# EAGLE design Swarm Board_2 (EAGLE 6.2)
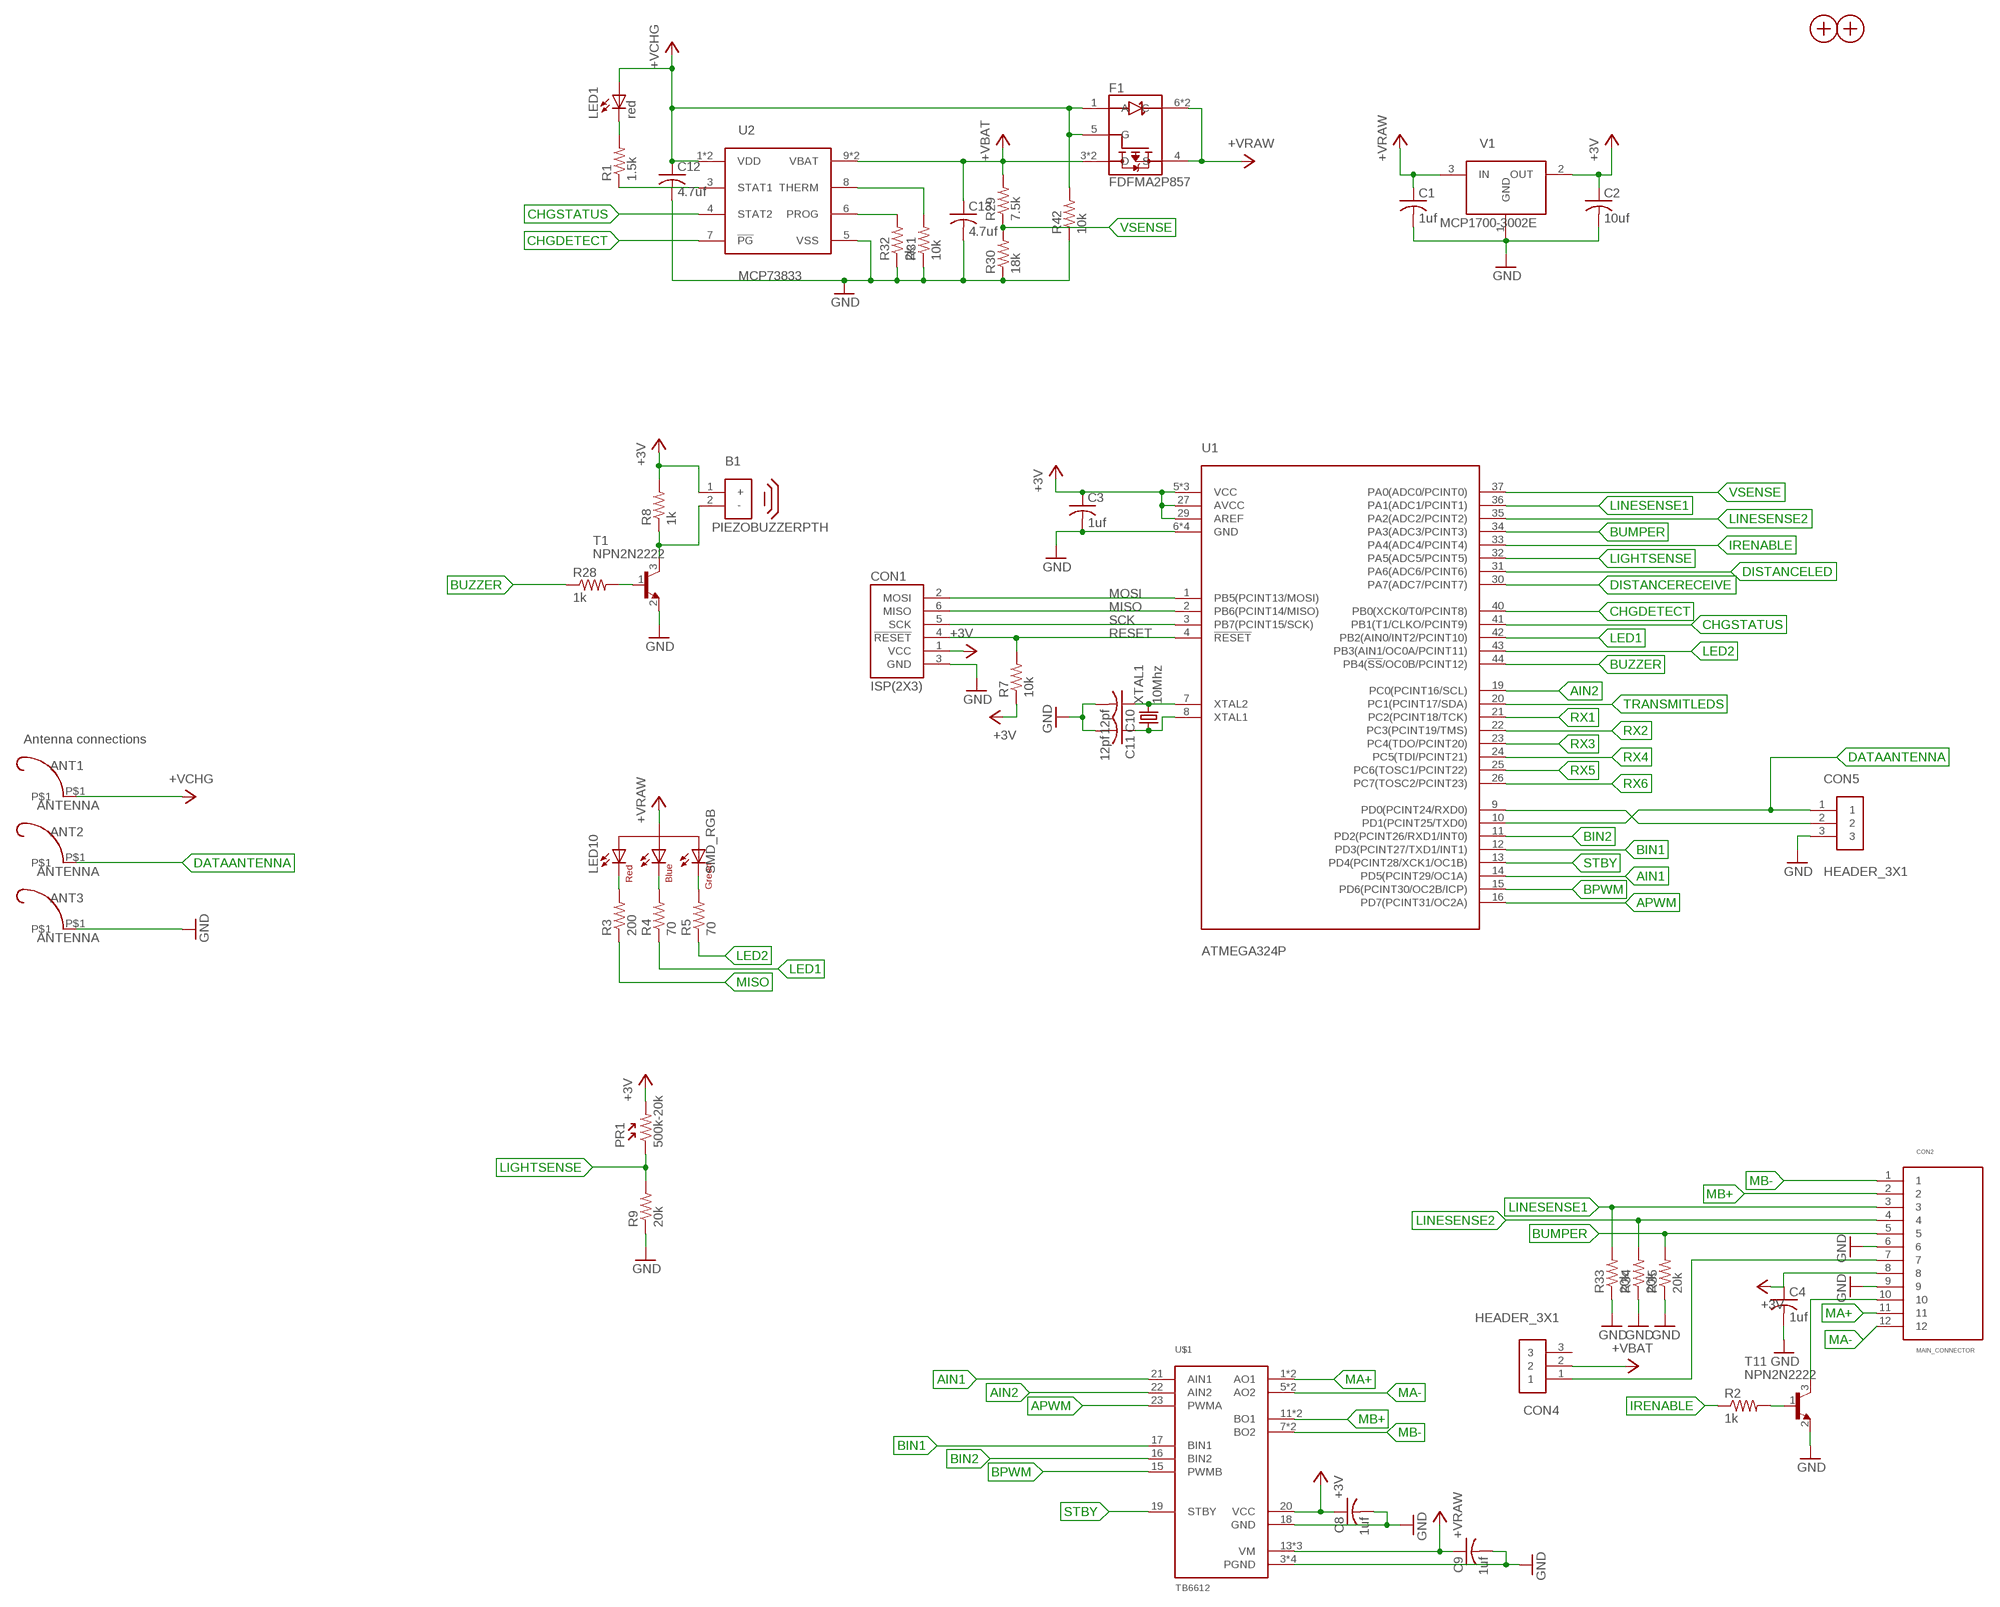
[diagram p0: schematic, sheet 1, part 1 of 2]
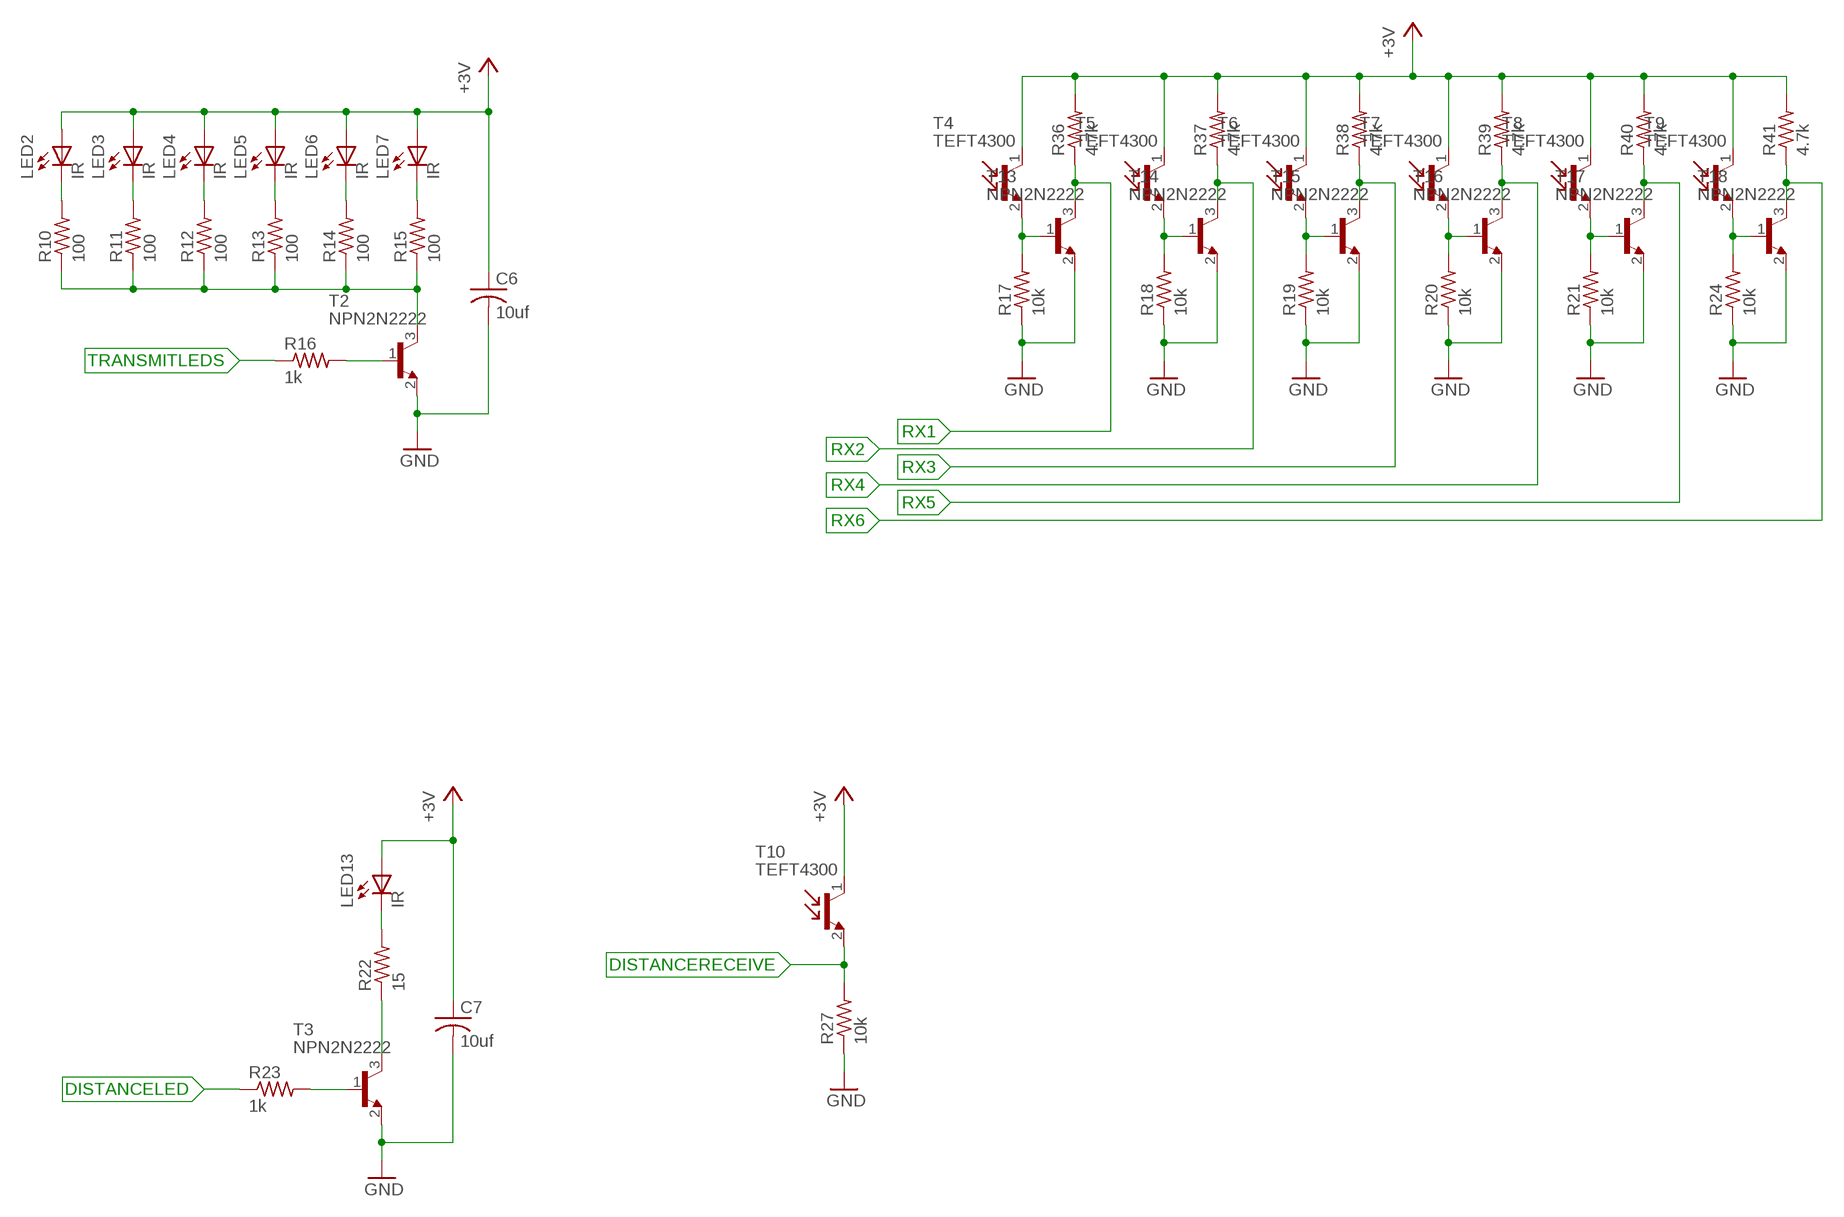
[diagram p1: schematic, sheet 1, part 2 of 2]

## Parts
ANT1  ANTENNA  [ANTENNA]
ANT2  ANTENNA  [ANTENNA]
ANT3  ANTENNA  [ANTENNA]
B1  PIEZOBUZZERPTH  [PIEZOBUZZER]
C1  1uf  CAP0603  [0603]
C2  10uf  CAP0805  [0805]
C3  1uf  CAP0603  [0603]
C4  1uf  CAP0603  [0603]
C6  10uf  CAP0805  [0805]
C7  10uf  CAP0805  [0805]
C8  1uf  CAP0603  [0603]
C9  1uf  CAP0603  [0603]
C10  12pf  CAP0603  [0603]
C11  12pf  CAP0603  [0603]
C12  4.7uf  CAP0603  [0603]
C13  4.7uf  CAP0603  [0603]
CON1  ISP(2X3)  [PINHEADER(2X3)]
CON2  MAIN_CONNECTOR  [FEMALE_HEADER_2MM_2X6]
CON4  HEADER_3X1  [3PINHEADER_.100"]
CON5  HEADER_3X1  [3PINHEADER_.100"]
F1  FDFMA2P857  [MICROFET2X2MM]
H1  MOUNTINGHOLE  [MOUNTINGHOLE]
H2  MOUNTINGHOLE  [MOUNTINGHOLE]
LED1  red  LED0603  [LED0603]
LED2  IR  LED5MMRA  [5MM_LED_RA]
LED3  IR  LED5MMRA  [5MM_LED_RA]
LED4  IR  LED5MMRA  [5MM_LED_RA]
LED5  IR  LED5MMRA  [5MM_LED_RA]
LED6  IR  LED5MMRA  [5MM_LED_RA]
LED7  IR  LED5MMRA  [5MM_LED_RA]
LED10  SMD_RGB  [PLCC4]
LED13  IR  LED5MMRA  [5MM_LED_RA]
PR1  500k-20k  CDSPHOTORESISTOR  [CDSPHOTOCELL]
R1  1.5k  RES0603  [0603]
R2  1k  RES0603  [0603]
R3  200  RES0603  [0603]
R4  70  RES0603  [0603]
R5  70  RES0603  [0603]
R7  10k  RES0603  [0603]
R8  1k  RES0603  [0603]
R9  20k  RES0603  [0603]
R10  100  RES0603  [0603]
R11  100  RES0603  [0603]
R12  100  RES0603  [0603]
R13  100  RES0603  [0603]
R14  100  RES0603  [0603]
R15  100  RES0603  [0603]
R16  1k  RES0603  [0603]
R17  10k  RES0603  [0603]
R18  10k  RES0603  [0603]
R19  10k  RES0603  [0603]
R20  10k  RES0603  [0603]
R21  10k  RES0603  [0603]
R22  15  RES0603  [0603]
R23  1k  RES0603  [0603]
R24  10k  RES0603  [0603]
R27  10k  RES0603  [0603]
R28  1k  RES0603  [0603]
R29  7.5k  RES0603  [0603]
R30  18k  RES0603  [0603]
R31  10k  RES0603  [0603]
R32  2k  RES0603  [0603]
R33  20k  RES0603  [0603]
R34  20k  RES0603  [0603]
R35  20k  RES0603  [0603]
R36  4.7k  RES0603  [0603]
R37  4.7k  RES0603  [0603]
R38  4.7k  RES0603  [0603]
R39  4.7k  RES0603  [0603]
R40  4.7k  RES0603  [0603]
R41  4.7k  RES0603  [0603]
R42  10k  RES0603  [0603]
T1  NPN2N2222  [SOT23]
T2  NPN2N2222  [SOT23]
T3  NPN2N2222  [SOT23]
T4  TEFT4300  [3MM_LED_RA]
T5  TEFT4300  [3MM_LED_RA]
T6  TEFT4300  [3MM_LED_RA]
T7  TEFT4300  [3MM_LED_RA]
T8  TEFT4300  [3MM_LED_RA]
T9  TEFT4300  [3MM_LED_RA]
T10  TEFT4300  [3MM_LED_RA]
T11  NPN2N2222  [SOT23]
T13  NPN2N2222  [SOT23]
T14  NPN2N2222  [SOT23]
T15  NPN2N2222  [SOT23]
T16  NPN2N2222  [SOT23]
T17  NPN2N2222  [SOT23]
T18  NPN2N2222  [SOT23]
U1  ATMEGA324P  [TQFP44]
U2  MCP73833  [MSOP10]
U$1  TB6612  [24SSOP]
V1  MCP1700-3002E  [(TT/NB)SOT-23(3PAD)]
XTAL1  10Mhz  NX5032GA-10.000000MHZ  [SMDXTAL]

## Nets
+3V: B1.1(+) C2.1 C3.1 C4.1 C6.1 C7.1 C8.1 CON1.1(VCC) CON2.8 LED2.1(A) LED3.1(A) LED4.1(A) LED5.1(A) LED6.1(A) LED7.1(A) LED13.1(A) PR1.2 R7.1 R8.2 R36.2 R37.2 R38.2 R39.2 R40.2 R41.2 T4.1(C) T5.1(C) T6.1(C) T7.1(C) T8.1(C) T9.1(C) T10.1(C) U1.5(VCC) U1.17(VCC) U1.27(AVCC) U1.29(AREF) U1.38(VCC) U$1.20(VCC) V1.2(OUT)
+VBAT: C13.1 CON4.2 F1.3(D) F1.8(D) R29.2 U2.9(VBAT) U2.10(VBAT)
+VCHG: ANT1.P$1 C12.1 F1.1(A) F1.5(G) LED1.2(A) R42.2 U2.1(VDD) U2.2(VDD)
+VRAW: C1.1 C9.1 F1.4(S) F1.6(C) F1.7(C) LED10.2(COMMONANODE) U$1.13(VM) U$1.14(VM) U$1.24(VM) V1.3(IN)
AIN1: U1.14(PD5(PCINT29/OC1A)) U$1.21(AIN1)
AIN2: U1.19(PC0(PCINT16/SCL)) U$1.22(AIN2)
APWM: U1.16(PD7(PCINT31/OC2A)) U$1.23(PWMA)
BIN1: U1.12(PD3(PCINT27/TXD1/INT1)) U$1.17(BIN1)
BIN2: U1.11(PD2(PCINT26/RXD1/INT0)) U$1.16(BIN2)
BPWM: U1.15(PD6(PCINT30/OC2B/ICP)) U$1.15(PWMB)
BUMPER: CON2.5 R35.2 U1.34(PA3(ADC3/PCINT3))
BUZZER: R28.1 U1.44(PB4(!SS!/OC0B/PCINT12))
CHGDETECT: U1.40(PB0(XCK0/T0/PCINT8)) U2.7(!PG)
CHGSTATUS: U1.41(PB1(T1/CLKO/PCINT9)) U2.4(STAT2)
DATAANTENNA: ANT2.P$1 CON5.1 U1.10(PD1(PCINT25/TXD0))
DISTANCELED: R23.1 U1.31(PA6(ADC6/PCINT6))
DISTANCERECEIVE: R27.2 T10.2(E) U1.30(PA7(ADC7/PCINT7))
GND: ANT3.P$1 C1.2 C2.2 C3.2 C4.2 C6.2 C7.2 C8.2 C9.2 C10.2 C11.2 C12.2 C13.2 CON1.3(GND) CON2.6 CON2.9 CON5.3 R9.1 R17.1 R18.1 R19.1 R20.1 R21.1 R24.1 R27.1 R30.1 R31.1 R32.1 R33.1 R34.1 R35.1 R42.1 T1.2(E) T2.2(E) T3.2(E) T11.2(E) T13.2(E) T14.2(E) T15.2(E) T16.2(E) T17.2(E) T18.2(E) U1.6(GND) U1.18(GND) U1.28(GND) U1.39(GND) U2.5(VSS) U$1.3(PGND) U$1.4(PGND) U$1.9(PGND) U$1.10(PGND) U$1.18(GND) V1.1(GND)
IRENABLE: R2.1 U1.33(PA4(ADC4/PCINT4))
LED1: R4.1 U1.42(PB2(AIN0/INT2/PCINT10))
LED2: R5.1 U1.43(PB3(AIN1/OC0A/PCINT11))
LIGHTSENSE: PR1.1 R9.2 U1.32(PA5(ADC5/PCINT5))
LINESENSE1: CON2.3 R33.2 U1.36(PA1(ADC1/PCINT1))
LINESENSE2: CON2.4 R34.2 U1.35(PA2(ADC2/PCINT2))
MA+: CON2.11 U$1.1(AO1) U$1.2(AO1)
MA-: CON2.12 U$1.5(AO2) U$1.6(AO2)
MB+: CON2.2 U$1.11(BO1) U$1.12(BO1)
MB-: CON2.1 U$1.7(BO2) U$1.8(BO2)
MISO: CON1.6(MISO) R3.1 U1.2(PB6(PCINT14/MISO))
MOSI: CON1.2(MOSI) U1.1(PB5(PCINT13/MOSI))
N$1: LED1.1(C) R1.2
N$4: R2.2 T11.1(B)
N$7: CON2.10 T11.3(C)
N$8: CON5.2 U1.9(PD0(PCINT24/RXD0))
N$9: B1.2(-) R8.1 T1.3(C)
N$10: R10.1 R11.1 R12.1 R13.1 R14.1 R15.1 T2.3(C)
N$11: R16.2 T2.1(B)
N$12: R22.1 T3.3(C)
N$13: LED2.2(C) R10.2
N$14: LED3.2(C) R11.2
N$15: LED4.2(C) R12.2
N$16: LED5.2(C) R13.2
N$17: LED6.2(C) R14.2
N$18: LED7.2(C) R15.2
N$19: R23.2 T3.1(B)
N$22: R31.2 U2.8(THERM)
N$23: C10.1 U1.7(XTAL2) XTAL1.2
N$24: C11.1 U1.8(XTAL1) XTAL1.1
N$25: LED13.2(C) R22.2
N$26: R28.2 T1.1(B)
N$27: R17.2 T4.2(E) T13.1(B)
N$28: R32.2 U2.6(PROG)
N$29: CON2.7 CON4.1
N$30: LED10.1(REDCATHODE) R3.2
N$31: LED10.3(BLUECATHODE) R4.2
N$32: LED10.4(GREENCATHODE) R5.2
N$33: R1.1 U2.3(STAT1)
N$34: R24.2 T9.2(E) T18.1(B)
N$35: R21.2 T8.2(E) T17.1(B)
N$36: R20.2 T7.2(E) T16.1(B)
N$37: R19.2 T6.2(E) T15.1(B)
N$38: R18.2 T5.2(E) T14.1(B)
RESET: CON1.4(!RESET) R7.2 U1.4(!RESET)
RX1: R36.1 T13.3(C) U1.21(PC2(PCINT18/TCK))
RX2: R37.1 T14.3(C) U1.22(PC3(PCINT19/TMS))
RX3: R38.1 T15.3(C) U1.23(PC4(TDO/PCINT20))
RX4: R39.1 T16.3(C) U1.24(PC5(TDI/PCINT21))
RX5: R40.1 T17.3(C) U1.25(PC6(TOSC1/PCINT22))
RX6: R41.1 T18.3(C) U1.26(PC7(TOSC2/PCINT23))
SCK: CON1.5(SCK) U1.3(PB7(PCINT15/SCK))
STBY: U1.13(PD4(PCINT28/XCK1/OC1B)) U$1.19(STBY)
TRANSMITLEDS: R16.1 U1.20(PC1(PCINT17/SDA))
VSENSE: R29.1 R30.2 U1.37(PA0(ADC0/PCINT0))
Unconnected: CON4.3

## Notes on the sheet
- Antenna connections

## Library data of the parts
ANT1-ANT3 = Mechanical:ANTENNA
B1 = Passive:PIEZOBUZZER: Digikey Part Number: 445-2525-1-ND Manufacturer Part Number: PS1240P02BT
C1-C4 C6-C13 = Passive:CAP
CON1 = Mechanical:ISP
CON2 = Mechanical:MAIN_CONNECTOR: Digikey Part Number: S5750-06-ND Manufacturer Part Number: NPPN062AFCN-RC
CON4 CON5 = Mechanical:HEADER_3X1
F1 = Passive:FDFMA2P857: Digikey Part Number: FDFMA2P857CT-ND Manufacturer Part Number: FDFMA2P857
H1 H2 = Mechanical:MOUNTINGHOLE
LED1-LED7 LED13 = Passive:LED
LED10 = Passive:SMD_RGB: Digikey Part Number: CLVBA-FKA-CAEDH8BBB7A363CT-ND Manufacturer Part Number: CLVBA-FKA-CAEDH8BBB7A363
PR1 = Passive:CDSPHOTORESISTOR: Digikey Part Number: PDV-P8103-ND Manufacturer Part Number: PDV-P8103
R1-R5 R7-R24 R27-R42 = Passive:RES
T1-T3 T11 T13-T18 = Passive:NPN2N2222: Digikey Part Number: 568-1738-1-ND Manufacturer Part Number: PMBT2222A,215
T4-T10 = Passive:TEFT4300: Digikey Part Number: 751-1041-ND Manufacturer Part number: TEFT4300
U1 = DigitalIC:ATMEGA324P: Digikey Part Number: ATMEGA324P-20AU-ND Manufacturer Part Number: ATMEGA324P-20AU
U2 = PowerIC:MCP73833: Manufacturer Part Number: MCP73833-AMI/UN Mouser Part Number: 579-MCP73833-AMI/UN
U$1 = DigitalIC:TB6612
V1 = PowerIC:MCP1700-3002E: Digikey Part Number: MCP1700T-3002E/TTCT-ND Manufacturer Part Number: MCP1700T-3002E/TT
XTAL1 = Passive:NX5032GA-10.000000MHZ: Digikey Part Number: 644-1033-1-ND Manufacturer Part Number: NX5032GA-10.000000MHZ-LN-CD-1

## Board
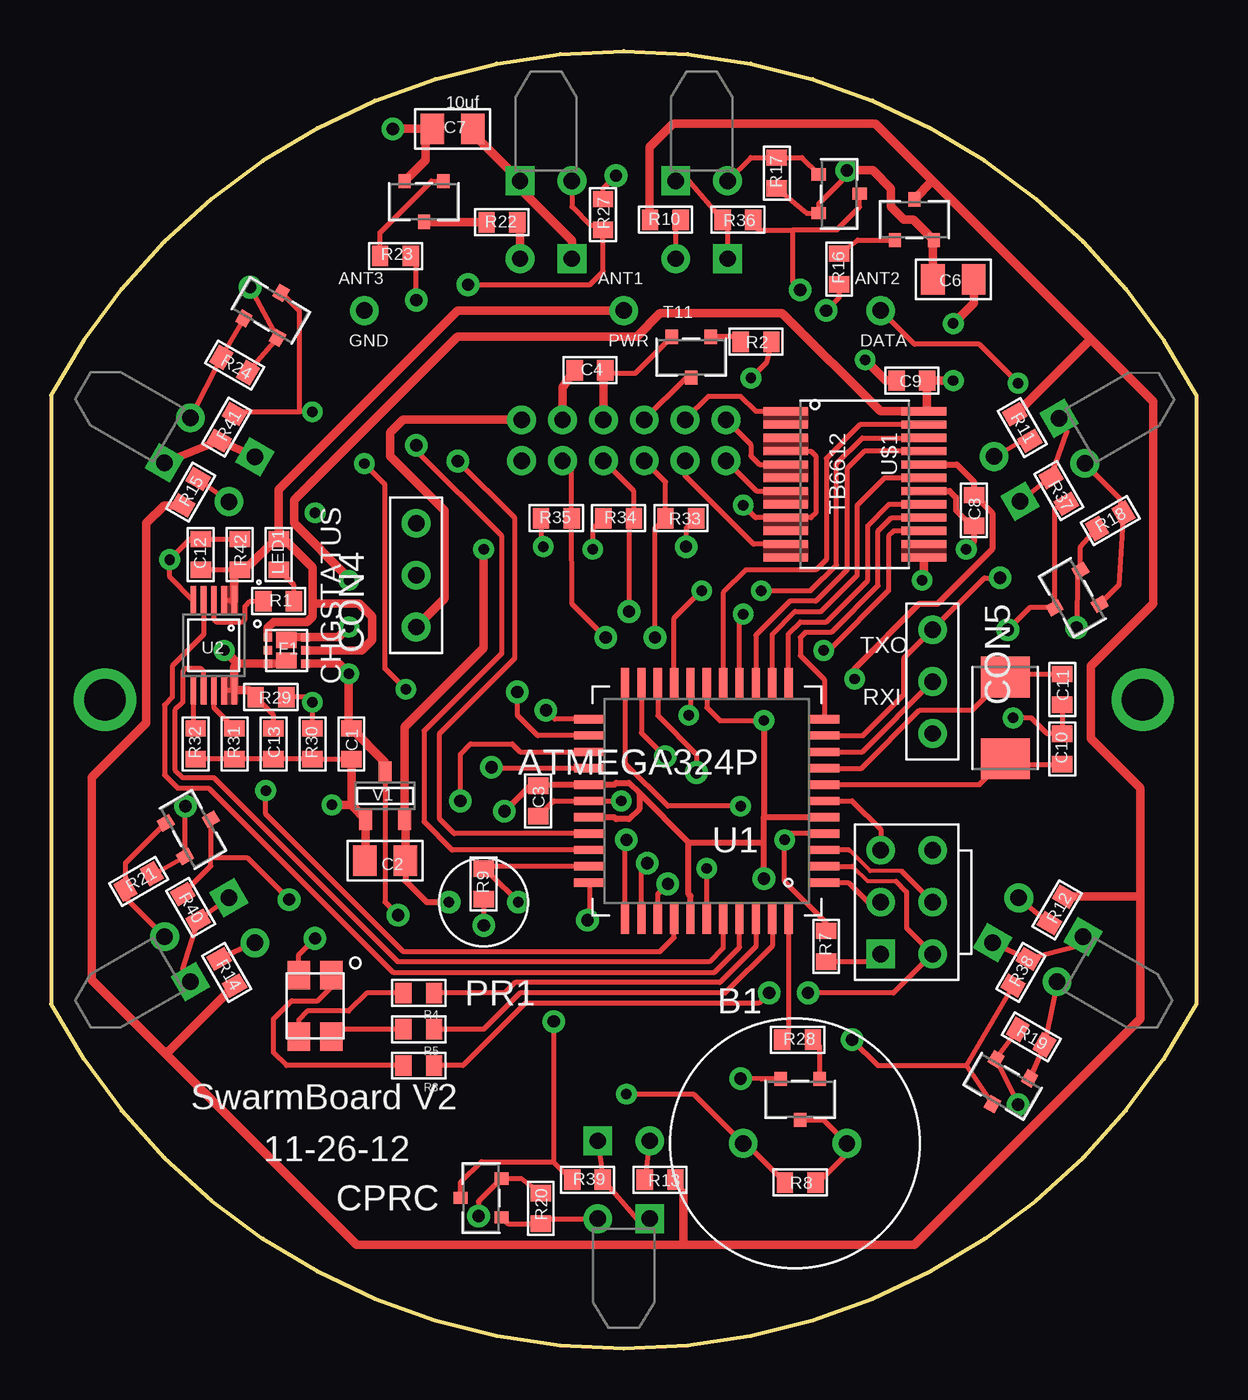
[diagram p2: board, top side]
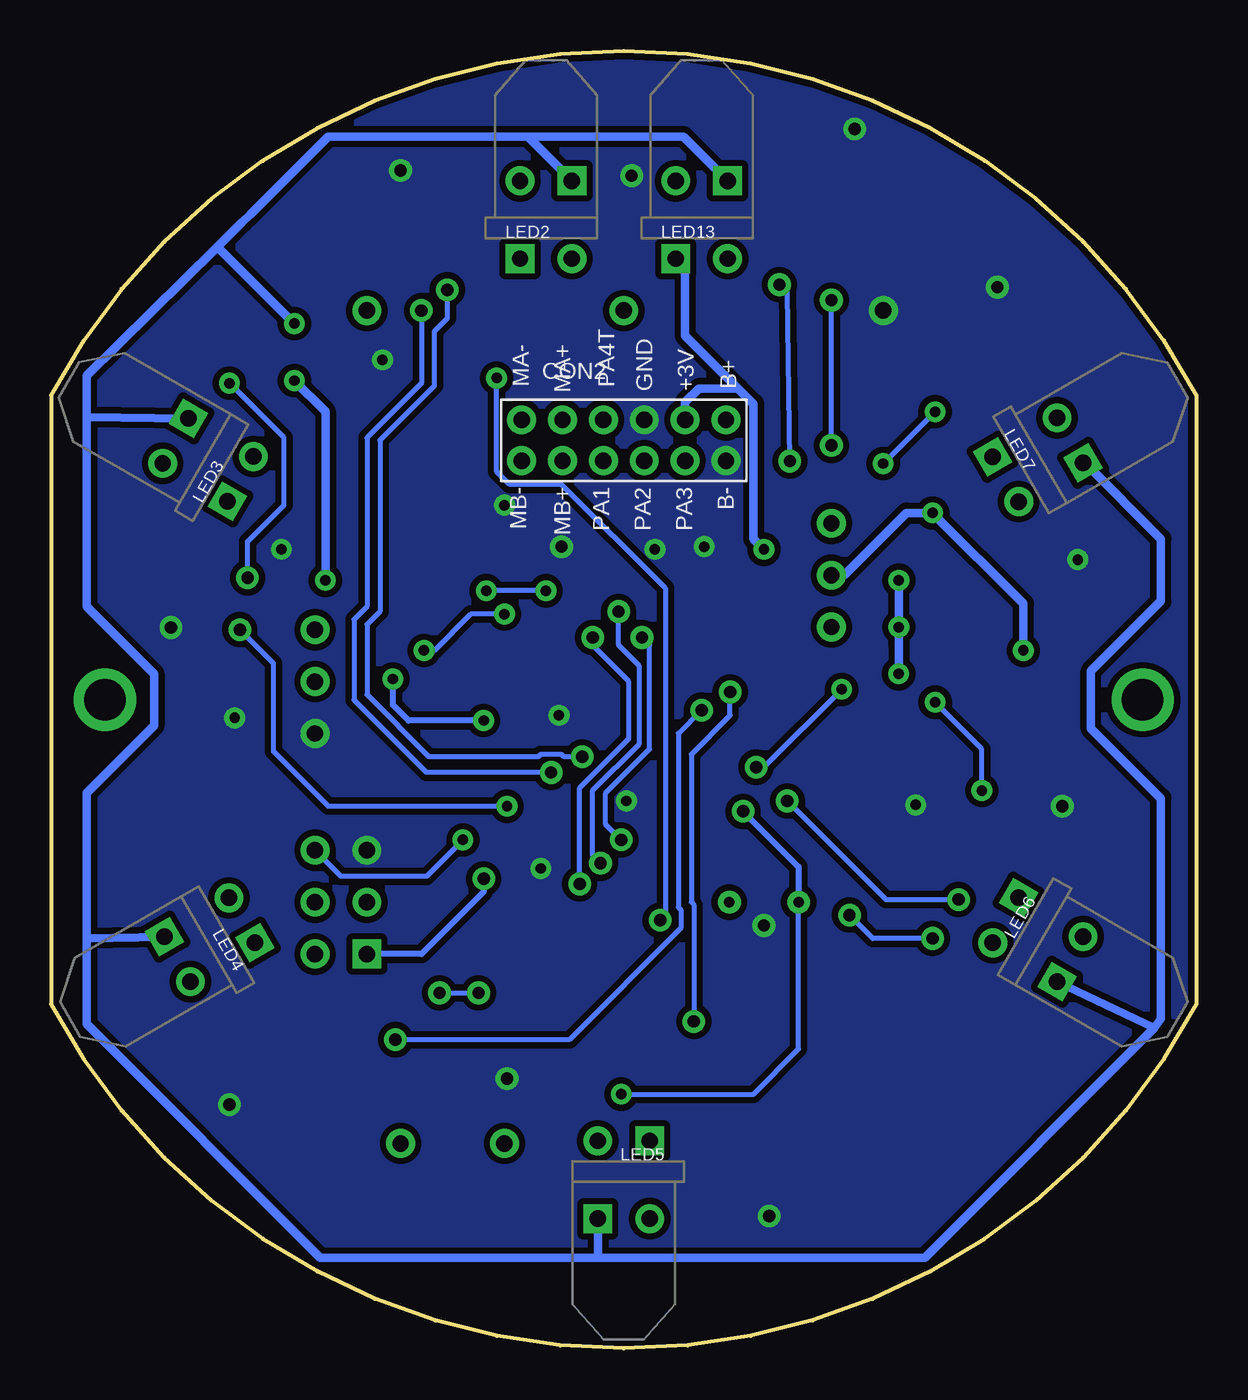
[diagram p3: board, bottom side, seen from below]

Size 56.07 x 63.5 mm. Coordinates in mm from the lower left corner, seen from the top.
Outline: 0,46.66 0,16.84 arc124 56.07,16.84 56.07,46.66 arc124 0,46.66
Copper layers (1*16): Top 0.035mm / dielectric 1.5mm / Bottom 0.035mm
Design rules: minimum track width 8mil, minimum drill 20mil, track to track 8mil, track to pad 8mil, pad to pad 8mil, via to via 8mil, smd to smd 8mil, copper to edge 10mil, drill to drill 8mil, minimum pad ring 12mil, minimum via ring 10mil, stop-mask expansion 4mil, vias tented up to drill 25mil, thermal gap 10mil

### Footprints (pad centres in the part's own frame; a part is rotated, then mirrored left to right if it is on the bottom)
ANTENNA = drill 0.8: P$1 0,0
PIEZOBUZZER = drill 0.8: 1 -2.54,0; 2 2.54,0
0603 = smd 0.8 x 1: 1 -0.75,0; 2 0.75,0
0805 = smd 1.15 x 1.5: 1 -1,0; 2 1,0
PINHEADER(2X3) = drill 0.8 square: 1 -2.54,1.27 | drill 0.8: 2 0,1.27; 3 2.54,1.27; 4 2.54,-1.27; 5 0,-1.27; 6 -2.54,-1.27
FEMALE_HEADER_2MM_2X6 = drill 0.8: 1 -5,-1; 2 -3,-1; 3 -1,-1; 4 1,-1; 5 3,-1; 6 5,-1; 7 5,1; 8 3,1; 9 1,1; 10 -1,1; 11 -3,1; 12 -5,1
3PINHEADER_.100" = drill 0.8: 1 -2.54,0; 2 0,0; 3 2.54,0
MICROFET2X2MM = smd 0.42 x 0.42: 1 -0.65,-0.915; 2 0,-0.915; 3 0.65,-0.915; 4 0.65,0.915; 5 0,0.915; 6 -0.65,0.915 | smd 0.78 x 1: 7 -0.5,0; 8 0.5,0
MOUNTINGHOLE = drill 2.032 pad 2.286: P$2 0,0
LED0603 = smd 0.8 x 1: 1 -0.75,0; 2 0.75,0
5MM_LED_RA = drill 0.8 square: 1 -1.27,0 | drill 0.8: 2 1.27,0
PLCC4 = smd 1.4 x 1.1: 1 -1.5,0.8; 2 -1.5,-0.8; 3 1.5,-0.8; 4 1.5,0.8
CDSPHOTOCELL = drill 0.508: 1 -1.694,0; 2 1.702,0
SOT23 = smd 0.6 x 0.7: 1 0.95,1; 2 -0.95,1; 3 0,-1
3MM_LED_RA = drill 0.8 square: 1 -1.27,0 | drill 0.8: 2 1.27,0
TQFP44 = smd 1.5 x 0.406: 1 -5.75,4; 2 -5.75,3.2; 3 -5.75,2.4; 4 -5.75,1.6; 5 -5.75,0.8; 6 -5.75,0; 7 -5.75,-0.8; 8 -5.75,-1.6; 9 -5.75,-2.4; 10 -5.75,-3.2; 11 -5.75,-4; 23 5.75,-4; 24 5.75,-3.2; 25 5.75,-2.4; 26 5.75,-1.6; 27 5.75,-0.8; 28 5.75,0; 29 5.75,0.8; 30 5.75,1.6; 31 5.75,2.4; 32 5.75,3.2; 33 5.75,4 | smd 0.406 x 1.5: 12 -4,-5.75; 13 -3.2,-5.75; 14 -2.4,-5.75; 15 -1.6,-5.75; 16 -0.8,-5.75; 17 0,-5.75; 18 0.8,-5.75; 19 1.6,-5.75; 20 2.4,-5.75; 21 3.2,-5.75; 22 4,-5.75; 34 4,5.75; 35 3.2,5.75; 36 2.4,5.75; 37 1.6,5.75; 38 0.8,5.75; 39 0,5.75; 40 -0.8,5.75; 41 -1.6,5.75; 42 -2.4,5.75; 43 -3.2,5.75; 44 -4,5.75
MSOP10 = smd 0.28 x 1.4: 1 -1,-2.2; 2 -0.5,-2.2; 3 0,-2.2; 4 0.5,-2.2; 5 1,-2.2; 6 1,2.2; 7 0.5,2.2; 8 0,2.2; 9 -0.5,2.2; 10 -1,2.2
24SSOP = smd 0.4 x 2.2: 1 -3.575,-3.378; 2 -2.925,-3.378; 3 -2.275,-3.378; 4 -1.625,-3.378; 5 -0.975,-3.378; 6 -0.325,-3.378; 7 0.325,-3.378; 8 0.975,-3.378; 9 1.625,-3.378; 10 2.275,-3.378; 11 2.925,-3.378; 12 3.575,-3.378; 13 3.575,3.378; 14 2.925,3.378; 15 2.275,3.378; 16 1.625,3.378; 17 0.975,3.378; 18 0.325,3.378; 19 -0.325,3.378; 20 -0.975,3.378; 21 -1.625,3.378; 22 -2.275,3.378; 23 -2.925,3.378; 24 -3.575,3.378
(TT/NB)SOT-23(3PAD) = smd 0.65 x 1.05: 1 -0.95,-1.15; 2 0.95,-1.15; 3 0,1.15
SMDXTAL = smd 2 x 2.4: 1 -2,0; 2 2,0

### Placement (x,y rotation side)
ANT1  28.03,50.8 0 top
ANT2  40.61,50.8 0 top
ANT3  15.33,50.8 0 top
B1  36.42,10.03 0 top
C1  14.7,29.59 270 top
C2  16.35,23.88 180 top
C3  23.84,26.8 270 top
C4  26.38,47.88 0 top
C6  44.16,52.32 180 top
C7  19.65,59.69 180 top
C8  45.18,41.02 270 top
C9  42.13,47.37 180 top
C10  49.5,29.34 90 top
C11  49.5,32.26 270 top
C12  7.33,38.86 90 top
C13  10.89,29.59 270 top
CON1  41.88,21.84 90 top
CON2  28.03,44.45 0 bottom
CON4  17.87,37.85 90 top
CON5  43.15,32.64 270 top
F1  11.52,34.16 270 top
H1  2.63,31.75 0 top
H2  53.43,31.75 0 top
LED1  11.14,38.86 90 top
LED2  31.84,53.34 0 bottom
LED3  46.79,42.56 60 bottom
LED4  46.73,20.95 120 bottom
LED5  28.03,10.16 180 bottom
LED6  9.34,20.95 240 bottom
LED7  9.34,42.54 300 bottom
LED10  12.92,16.76 270 top
LED13  24.22,53.34 0 bottom
PR1  21.18,21.84 180 top
R1  11.14,36.58 0 top
R2  34.51,49.28 180 top
R3  18,13.84 180 top
R4  18,17.4 180 top
R5  18,15.62 180 top
R7  37.94,19.68 90 top
R8  36.67,8.13 180 top
R9  21.18,22.73 90 top
R10  30.07,55.24 0 top
R11  47.54,45.07 300 top
R12  49.24,21.46 240 top
R13  29.81,8.25 180 top
R14  8.6,18.41 120 top
R15  6.82,41.91 60 top
R16  38.57,52.83 90 top
R17  35.53,57.53 90 top
R18  51.84,40.51 30 top
R19  47.97,15.24 330 top
R20  23.97,6.86 270 top
R21  4.28,22.86 210 top
R22  22.06,55.12 0 top
R23  16.86,53.47 180 top
R24  8.98,48.13 150 top
R27  27.02,55.5 270 top
R28  36.54,15.11 0 top
R29  10.76,31.88 180 top
R30  12.79,29.59 90 top
R31  8.98,29.59 90 top
R32  7.08,29.59 90 top
R33  30.83,40.64 180 top
R34  27.78,40.64 0 top
R35  24.73,40.64 0 top
R36  33.62,55.24 180 top
R37  49.32,41.99 120 top
R38  47.46,18.41 60 top
R39  26.26,8.25 0 top
R40  6.82,21.59 300 top
R41  8.6,45.08 240 top
R42  9.24,38.86 270 top
T1  36.67,12.19 0 top
T2  42.26,55.24 180 top
T3  18.25,56.13 0 top
T4  31.84,57.15 0 top
T5  49.97,44.42 300 top
T6  49.88,19.05 240 top
T7  28.03,6.35 180 top
T8  6.19,19.05 120 top
T9  6.19,44.45 60 top
T10  24.22,57.15 0 top
T11  31.34,48.51 0 top
T13  38.57,56.51 90 top
T14  49.99,36.75 300 top
T15  46.58,12.83 330 top
T16  21.05,7.37 270 top
T17  6.95,25.4 120 top
T18  10.76,50.8 150 top
U1  32.1,26.8 180 top
U2  7.97,34.42 180 top
U$1  39.34,42.29 270 top
V1  16.35,27.05 0 top
XTAL1  46.7,30.86 270 top

### Tracks (layer width: path | path; a pad name or v marks a point on that pad's centre or on a via)
+3V  (via drill 0.51, 0.6 pad 0.41)
  Top 0.254: LED2.1 33.11,55.24 R36.2 31.22,57.15 T4.1 | LED3.1 47.44,41.48 R37.2 49.72,44.85 T5.1 | LED4.1 R38.2 50.26,19.68 T6.1 | LED5.1 R39.2 28.66,6.35 T7.1 | LED6.1 R40.2 6.44,18.54 T8.1 | 35.77,8.14 R8.2 34.01,10.03 B1.1 31.46,12.45 v28.16,12.45 | C3.1 23.58,27.68 | U1.17 32.1,31.37 32.73,30.73 v34.89,30.73 | R7.1 40.24,18.93 CON1.1
  Top 0.305: C3.1 24.56,27.6 U1.27 27.56,27.6 27.65,27.69 28.29,27.69 28.8,27.18 | 28.8,27.18 28.8,26.42 28.29,25.91 27.65,25.91 27.56,26 U1.29 | U1.38 31.3,22.14 31.21,22.22 31.21,24.76 | U1.5 34.89,26 | 31.21,24.76 28.8,27.18 | v34.89,22.99 34.89,24.76 | 34.89,24.76 34.89,26 | v34.89,30.73 34.89,26 | 23.58,27.68 v22.19,26.29 | C2.1 17.35,22.88 18.38,21.84 PR1.2 | v39.34,32.77 39.34,33.27 42.51,36.45 43.4,36.45 46.07,39.12 46.07,40.89 C8.1 | U$1.20 44.33,43.27 45.18,42.42 C8.1 | C8.1 45.44,41.65 | 31.21,24.76 34.89,24.76
  Top 0.406: LED13.1 25.49,54.23 22.95,56.77 T10.1 20.79,59.31 C7.1 | LED7.1 R41.2 T9.1 | CON2.8 25.03,47.03 C4.1 | C6.1 45.16,51.16 v44.16,50.16 | v21.18,39.12 21.18,34.29 17.3,30.41 V1.2 17.35,25.85 C2.1
  Bottom 0.254: PR1.2 19.47,14.66 21.68,12.45 v28.16,12.45 | 47.85,53.85 47.98,53.85
  Bottom 0.305: 5.47,43.35 T9.1 | v22.19,26.29 19.47,23.57 PR1.2 | v34.89,30.73 38.57,30.73 39.34,31.5 v39.34,32.77 | CON1.1 37.94,19.3 34.89,22.35 v34.89,22.99
  Bottom 0.406: 32.73,59.31 42.51,59.31 46.32,55.5 46.7,55.12 47.98,53.85 54.32,47.62 54.32,45.59 | 32.73,59.31 T4.1 | T10.1 25.11,59.31 32.73,59.31 | 54.32,45.59 54.32,36.32 51.02,33.02 51.02,30.48 54.32,27.18 54.32,20.07 | 54.32,20.07 54.32,15.87 42.89,4.44 29.3,4.44 | 29.3,4.44 13.3,4.44 2.06,15.68 | 2.06,15.68 1.74,16.13 1.74,26.92 5.17,30.35 5.17,33.15 1.74,36.58 1.74,39.62 5.47,43.35 | T5.1 54.32,45.59 | T6.1 54.32,20.07 | T7.1 29.3,4.44 | T8.1 2.06,15.68 | CON2.8 25.03,46.31 24.35,46.99 22.45,46.99 | 22.45,46.99 21.68,46.23 21.68,39.62 v21.18,39.12 | 22.45,46.99 25.03,49.58 25.03,52.88 LED13.1 | v44.16,50.16 47.85,53.85
+VBAT  (via drill 0.51)
  Top 0.254: U2.9 U2.10 | C13.1 10.89,31 R29.2
  Top 0.406: 9.13,33.51 F1.3 11.37,33.51 F1.8 | 9.13,33.51 v8.48,34.16 | R29.2 9.67,32.22 U2.10 8.97,33.35 9.13,33.51
  Bottom 0.406: v8.48,34.16 8.48,36.45 v12.92,40.89 14.19,40.89 17.24,37.85 CON4.2
  pour Top (no thermals): 8.48,32.83 9.05,32.83 9.05,31.62 8.48,31.62
+VCHG
  Top 0.254: 8.86,36.51 U2.1 U2.2 | LED1.2 11.01,39.5 | C12.1 R42.2
  Top 0.406: ANT1.P$1 19.91,50.8 11.14,42.04 LED1.2 11.4,39.62 12.79,38.23 12.79,36.45 | F1.5 15.21,34.16 15.71,34.67 15.71,35.81 15.08,36.45 12.79,36.45 | F1.1 10.61,35.28 10.89,35.56 12.54,35.56 12.79,35.81 12.79,36.45 | 11.01,39.5 10.89,39.5 9.75,38.36 R42.2 8.97,38.09 U2.1
  pour Top (no thermals): 8.48,37.21 9.05,37.21 9.05,36 8.48,36
+VRAW  (via drill 0.51, 0.6)
  Top 0.254: 11.8,34.81 F1.7 | LED10.2 12.12,19.27 v12.92,20.07 | V1.3 16.35,21.84 v16.98,21.21
  Top 0.406: 11.8,34.81 F1.6 14.08,34.81 v14.57,35.31 | F1.4 14.09,33.51 v14.57,33.02 14.57,30.49 C1.1 16.35,28.69 V1.3 | v44.16,47.37 C9.1 42.88,46.03 U$1.24 40.59,45.87 35.78,50.67 29.81,50.67 28.67,49.53 19.91,49.53 11.9,41.53 11.9,40.39 14.57,37.72 v14.57,37.59 | v42.64,37.59 42.71,37.67 U$1.13
  Bottom 0.254: v12.92,20.07 15.84,20.07 v16.98,21.21
  Bottom 0.406: v14.57,33.02 14.57,34.41 v14.57,35.31 v14.57,37.59 | v44.16,47.37 42.64,45.85 v42.64,37.59
  pour Top (no thermals): 43.69,39.45 43.69,38.65 41.74,38.65 41.74,39.45
AIN1
  Top 0.254: U$1.21 39.82,43.92 38.96,43.05 38.96,38.1 37.43,36.58 36.16,36.58 34.5,34.91 U1.14
AIN2  (via drill 0.51)
  Top 0.254: U1.19 30.5,35.74 v31.84,37.08 | v34.76,37.08 37.18,37.08 38.45,38.35 38.45,43.31 39.71,44.57 U$1.22
  Bottom 0.254: v31.84,37.08 v34.76,37.08
APWM
  Top 0.254: U$1.23 39.59,45.22 37.94,43.56 37.94,38.61 37.43,38.1 34,38.1 32.9,36.99 U1.16
BIN1
  Top 0.254: U1.12 36.1,34.99 36.67,35.56 37.94,35.56 39.97,37.59 39.97,40.26 41.03,41.32 U$1.17
BIN2
  Top 0.254: U$1.16 41.14,40.67 40.48,40 40.48,37.34 38.19,35.05 36.92,35.05 36.67,34.8 36.67,33.91 37.85,32.73 U1.11
BPWM  (via drill 0.51)
  Top 0.254: U1.15 33.7,35.76 v33.88,35.94 | U$1.15 41.25,40.02 40.99,39.75 40.99,37.08 38.07,34.16 v37.81,34.16
  Bottom 0.254: v33.88,35.94 35.53,35.94 37.3,34.16 v37.81,34.16
BUMPER  (via drill 0.6 pad 0.41)
  Top 0.254: U1.34 28.1,24.83 v28.16,24.89 | v27.14,34.8 25.5,36.44 R35.2 25.48,43 CON2.5
  Bottom 0.254: v28.16,24.89 28.92,25.65 28.92,27.18 26.76,29.34 26.76,34.42 v27.14,34.8
BUZZER
  Top 0.254: U1.44 36.1,15.42 R28.1
CHGDETECT
  Top 0.254: U2.7 7.47,33.14 7.33,33.27 6.57,33.27 6.44,33.15 6.44,31.62 6.06,31.24 6.06,28.32 6.44,27.94 7.97,27.94 16.98,18.92 32.22,18.92 32.9,19.6 U1.40
CHGSTATUS
  Top 0.254: U2.4 7.47,34.93 5.94,33.4 5.94,31.88 5.55,31.5 5.55,28.07 6.19,27.43 7.71,27.43 16.73,18.41 32.48,18.41 33.7,19.63 U1.41
DATAANTENNA  (via drill 0.51, 0.6)
  Top 0.254: U1.10 39.74,30 41.75,32 41.75,33.78 CON5.1 45.69,37.72 45.94,37.72 v46.45,37.72 | v47.34,47.24 45.43,49.15 42.26,49.15 ANT2.P$1
  Bottom 0.254: v47.34,47.24 44.67,44.58 44.67,41.27 46.45,39.5 v46.45,37.72
DISTANCELED  (via drill 0.6 pad 0.41)
  Top 0.254: U1.31 19.64,24.4 18.25,25.78 18.25,30.23 22.06,34.04 22.06,39.75 17.87,43.94 v17.87,44.2 | v17.87,51.31 17.87,52.95 R23.1
  Bottom 0.254: v17.87,44.2 v17.87,51.31
DISTANCERECEIVE  (via drill 0.6 pad 0.41)
  Top 0.254: T10.2 25.49,55.88 26.38,54.99 27.01,54.99 R27.2 27.02,52.7 26.38,52.07 v20.41,52.07 | U1.30 19.73,25.2 19.02,25.91 19.02,30.1 22.7,33.78 22.7,40.64 v19.91,43.43
  Bottom 0.254: v19.91,43.43 20.03,51.69 v20.41,52.07
GND  (via drill 0.51, 0.6 pad 0.41, 0.6 pad 0.51)
  Top 0.254: C11.2 C10.2 48.74,30.09 47.97,30.86 v47.08,30.86 | U1.18 31.3,31.08 v31.21,30.99 | v27.91,26.8 U1.28 24.6,26.8 C3.2 | U1.39 v32.1,23.49 | v50.2,35.28 50.22,37.93 T14.2 50.38,39.23 R18.1 | R27.1 27.02,56.77 v27.65,57.4 | R19.1 T15.2 v47.34,11.94 | 24.15,7.43 R20.1 23.01,8.32 T16.2 20.92,7.19 v20.92,6.48 | R24.1 T18.2 v9.75,51.94 | T1.2 34.75,13.19 v33.75,13.21 | R9.1 v21.18,20.7 | C7.2 18.32,59.26 | v31.08,39.24 31.08,40.14 31.2,40.26 R33.1 | R32.1 R31.1 C13.2 R30.1 C1.2 | v26.51,39.12 26.51,40.12 R34.1 | R35.1 23.98,39.38 v24.1,39.24 | 27.03,47.73 28.6,47.73 T11.2 | R21.1 4.83,23.11 T17.2 v6.57,26.54 | R17.1 36.99,55.56 T13.2 37.57,56.02 38.7,57.15 38.7,57.4 | T2.2 43.16,54.2 | U2.5 5.81,37.78 v5.81,38.61 6.82,39.62 C12.2 R42.1 | U$1.4 37.2,43.92 37.43,43.69 37.43,40.89 37.2,40.67 U$1.9 34.48,40.67 v33.88,41.27 | U1.6 39.21,26.8 40.61,25.4 CON1.3
  Top 0.305: U$1.18 43.98,41.97 44.29,41.66 44.29,41.02 45.04,40.27 C8.2 45.18,39.5 v44.8,39.12
  Top 0.406: C7.2 v16.73,59.69 | 27.01,47.63 C4.2 27.03,47.73 CON2.9 | T3.2 18.32,58.15 18.32,59.26 | 38.7,57.4 v38.96,57.66 40.23,57.66 41.11,56.77 41.11,55.88 41.75,55.24 42.21,55.24 T2.2 | 43.16,54.2 C6.2 | C2.2 15.4,23.93 V1.1 14.7,26.6 | 14.7,26.6 v13.75,26.61 | 14.7,26.6 C1.2 | C9.2 40.86,47.37 v39.84,48.39
  Bottom 0.254: v33.88,41.27 33.62,41.27
  pour Bottom (isolate 0.305, no thermals): 12.29,61.21 23.72,66.29 43.27,63.25 59.02,47.24 63.09,26.42 51.4,4.06 23.97,-4.06 0.35,8.64 -5.62,28.07 -4.35,48.01 9.75,60.2
  pour Top (no thermals): 36.95,44.63 36.95,43.84 34.98,43.84 34.98,44.64
  pour Top (no thermals): 36.95,40.74 36.95,39.94 34.98,39.94 34.98,40.74
IRENABLE  (via drill 0.51, 0.6 pad 0.41)
  Top 0.254: U1.33 26.35,21.05 v26.26,20.95 | R2.1 35.02,48.26 v34.26,47.5
  Bottom 0.254: v34.26,47.5 34.26,42.93 33.62,42.29 31.08,42.29 26,37.21 26,21.21 v26.26,20.95
LED1
  Top 0.254: U1.42 34.5,19.67 32.73,17.91 22.7,17.91 22.19,17.4 R4.1
LED2
  Top 0.254: U1.43 35.3,19.71 32.99,17.4 22.95,17.4 21.18,15.62 R5.1
LIGHTSENSE
  Top 0.254: PR1.1 21.48,23.23 R9.2 21.54,23.6 U1.32
LINESENSE1  (via drill 0.6 pad 0.41)
  Top 0.254: U1.36 29.7,22.24 v30.19,22.73 | v29.56,34.8 29.56,40.14 R33.2 30.08,42.41 CON2.3
  Bottom 0.254: v30.19,22.73 30.19,27.43 27.78,29.84 27.78,32.64 29.56,34.42 v29.56,34.8
LINESENSE2  (via drill 0.6 pad 0.41)
  Top 0.254: U1.35 28.9,23.47 v29.18,23.75 | v28.29,36.07 28.29,40.63 R34.2 28.53,41.95 CON2.4
  Bottom 0.254: v29.18,23.75 29.56,24.13 29.56,27.3 27.27,29.59 27.27,33.4 28.29,34.42 v28.29,36.07
MA+
  Top 0.254: CON2.11 32.19,46.61 33.75,46.61 34.49,45.87 U$1.1
  pour Top (no thermals): 36.95,45.94 36.95,45.15 34.98,45.15 34.98,45.95
MA-
  Top 0.254: CON2.12 34.26,44.23 34.26,43.69 34.68,43.27 U$1.5
  pour Top (no thermals): 36.95,43.34 36.95,42.54 34.98,42.54 34.98,43.35
MB+
  Top 0.254: U$1.11 34.39,39.37 31.03,42.72 CON2.2
  pour Top (no thermals): 36.95,39.44 36.95,38.65 34.98,38.65 34.98,39.45
MB-
  Top 0.254: CON2.1 34.52,41.97 U$1.7
  pour Top (no thermals): 36.95,42.03 36.95,41.24 34.98,41.24 34.98,42.04
MISO  (via drill 0.6)
  Top 0.203: 41.37,22.86 39.97,22.86 39.23,23.6
  Top 0.254: 41.37,22.86 41.88,22.35 41.88,20.57 CON1.6 41.24,17.4 v37.05,17.4 | U1.2 39.23,23.6 | v35.15,17.4 34.64,16.89 23.21,16.89 20.16,13.84 R3.1
  Bottom 0.254: v37.05,17.4 v35.15,17.4
MOSI
  Top 0.203: U1.1 37.81,22.76
  Top 0.254: 40.35,21.84 CON1.2 39.97,21.84 39.02,22.8 U1.1
N$1
  Top 0.254: R1.2 11.89,37.36 LED1.1
N$4
  Top 0.254: R2.2 33.79,49.53 T11.1
N$7
  Top 0.254: T11.3 31.07,47.5 CON2.10
N$8
  Top 0.254: U1.9 39.7,29.2 CON5.2
N$9
  Top 0.254: R8.1 37.57,8.13 38.96,9.52 B1.2 37.8,11.19 T1.3
N$10
  Top 0.254: R10.1 29.56,55.24 29.3,55.5 | R11.1 47.29,45.8 | R14.1 8.73,17.53 | R13.1 30.95,7.61 | T2.3 42.26,56.26 | 53.29,22.11 53.31,22.1
  Top 0.406: 29.3,55.5 29.3,58.8 30.45,59.94 40.35,59.94 43.15,57.15 | 47.29,45.8 50.89,49.4 | 5.49,14.54 2,18.03 2,27.94 4.67,30.61 4.67,40.39 5.54,41.26 R15.1 | 5.49,14.54 14.95,5.08 30.95,5.08 | 30.95,5.08 42.26,5.08 53.31,16.13 53.31,22.1 53.31,27.43 50.89,29.84 50.89,33.4 53.94,36.45 53.94,46.35 50.89,49.4 | 8.73,17.53 5.74,14.54 5.49,14.54 | 30.95,7.61 30.95,5.08 | 43.15,57.15 50.89,49.4 | 42.26,56.26 43.15,57.15 | R12.1 53.29,22.11
N$11
  Top 0.254: R16.2 39.49,54.24 T2.1
N$12
  Top 0.254: T3.3 18.65,55.12
  Top 0.406: 18.65,55.12 R22.1
N$13
  Top 0.254: R10.2 30.57,55.24 LED2.2
N$14
  Top 0.254: LED3.2 47.78,44.59 R11.2
N$15
  Top 0.254: LED4.2 R12.2
N$16
  Top 0.254: LED5.2 R13.2
N$17
  Top 0.254: LED6.2 R14.2
N$18
  Top 0.254: R15.2 LED7.2
N$19
  Top 0.254: R23.2 16.1,54.62 18.62,57.13 T3.1
N$22
  Top 0.254: U2.8 7.97,31.36 R31.2
N$23
  Top 0.254: U1.7 45.44,27.6 XTAL1.2 46.98,28.59 C10.1
N$24
  Top 0.254: U1.8 39.67,28.4 42.51,31.24 45.08,31.24 XTAL1.1 46.85,33.01 C11.1
N$25
  Top 0.254: R22.2 22.95,55.11
  Top 0.406: 22.95,55.11 LED13.2
N$26
  Top 0.254: R28.2 37.62,14.79 T1.1
N$27
  Top 0.254: T13.1 36.75,58.28 R17.2 34.25,58.28 T4.2
N$28
  Top 0.254: U2.6 6.97,30.61 R32.2
N$29
  Top 0.406: CON2.7 17.22,45.45 16.6,44.83 16.6,43.69 19.27,41.02 19.27,36.7 CON4.1
N$30
  Top 0.254: R3.2 11.52,13.84 10.89,14.48 10.89,16.13 11.78,17.02 13.05,17.02 13.72,17.69 LED10.1
N$31
  Top 0.254: R4.2 15.46,17.4 14.57,16.51 12.54,16.51 12.12,16.09 LED10.3
N$32
  Top 0.254: R5.2 14.08,15.62 LED10.4
N$33
  Top 0.254: U2.3 7.97,35.69 8.09,35.56 9.36,35.56 9.49,35.69 9.49,36.32 9.75,36.58 R1.1
N$34
  Top 0.254: T9.2 R24.2 T18.1
N$35
  Top 0.254: T17.1 3.63,23.75 R21.2 3.63,22.07 T8.2
N$36
  Top 0.254: T7.2 24.23,6.35 R20.2 22.36,6.11 T16.1
N$37
  Top 0.254: T6.2 R19.2 T15.1
N$38
  Top 0.254: T5.2 52.28,41.65 R18.2 52.28,37.37 T14.1
RESET  (via drill 0.51)
  Top 0.254: U1.4 36.21,25.2 v35.91,24.89 35.91,22.85 37.94,20.82 R7.2
  Bottom 0.254: v35.91,24.89 37.69,23.11 41.88,23.11 CON1.4
RX1  (via drill 0.6 pad 0.41)
  Top 0.254: 36.29,54.74 38.45,54.74 39.57,55.86 T13.3 | R36.1 34.63,54.74 36.29,54.74 | U1.21 28.9,30.12 v30.07,28.96 | 36.29,54.74 36.29,52.2 v36.67,51.82
  Bottom 0.254: v30.07,28.96 30.95,28.96 31.08,29.08 32.1,29.08 32.22,28.96 37.56,28.96 40.61,32 40.61,35.43 39.97,36.07 39.97,44.45 37.3,47.12 37.3,49.78 36.67,50.42 v36.67,51.82
RX2  (via drill 0.51, 0.6 pad 0.41)
  Top 0.254: U1.22 28.1,28.64 30.19,26.54 v33.75,26.54 | R37.1 49.12,41.11 T14.3 47.9,36.25 v46.83,35.18
  Bottom 0.254: v46.83,35.18 45.18,33.53 45.18,29.21 42.51,26.54 v33.75,26.54
RX3  (via drill 0.6 pad 0.41)
  Top 0.254: R38.1 44.8,13.84 | 44.8,13.84 T15.3 | U1.23 24.67,30.8 v24.22,31.24 | v39.21,15.11 40.48,13.84 44.8,13.84
  Bottom 0.254: v24.22,31.24 25.37,30.1 25.37,21.59 25.24,21.46 25.24,20.57 30.7,15.11 v39.21,15.11
RX4  (via drill 0.6 pad 0.41)
  Top 0.254: T16.3 20.05,8.14 21.05,9.14 24.6,9.14 | R39.1 24.6,9.14 | U1.24 23.82,30 22.83,30.99 v22.83,32.13 | v24.6,16 24.6,9.14
  Bottom 0.254: v24.6,16 24.6,21.72 24.73,21.84 24.73,29.08 22.83,30.99 v22.83,32.13
RX5  (via drill 0.6 pad 0.41)
  Top 0.254: v20.03,26.8 20.03,29.08 20.54,29.59 22.57,29.59 22.97,29.2 U1.25 | T17.3 7.82,24 | v11.65,21.97 9.62,24 7.82,24 | R40.1 7.82,23.61 7.82,24
  Bottom 0.254: v20.03,26.8 15.21,21.97 v11.65,21.97
RX6  (via drill 0.51, 0.6 pad 0.41)
  Top 0.254: T18.3 12.16,50.77 12.16,45.85 | R41.1 8.98,45.72 9.11,45.85 12.16,45.85 | U1.26 21.63,28.4 v21.56,28.45 | v17.37,32.26 16.35,33.27 16.35,42.29 v15.33,43.31 | v12.79,45.85 12.16,45.85
  Bottom 0.254: v17.37,32.26 21.18,28.45 v21.56,28.45 | v15.33,43.31 v12.79,45.85
SCK
  Top 0.203: 41.62,23.37 40.1,23.37 39.07,24.4
  Top 0.254: 39.07,24.4 U1.3 | CON1.5 41.62,23.37
STBY
  Top 0.254: U1.13 35.3,34.95 36.42,36.07 37.69,36.07 39.46,37.85 39.46,41.27 40.8,42.62 U$1.19
TRANSMITLEDS  (via drill 0.6 pad 0.41)
  Top 0.254: U1.20 29.7,30.97 31.59,29.08 v31.59,28.19 | R16.1 38.57,51.43 v37.94,50.8
  Bottom 0.254: v31.59,28.19 37.69,28.19 41.24,31.75 41.24,35.69 40.61,36.32 40.61,44.58 37.94,47.24 v37.94,50.8
VSENSE  (via drill 0.51)
  Top 0.254: U1.37 30.5,20.12 29.81,19.43 17.24,19.43 10.51,26.16 v10.51,27.3 | 11.33,31.62 R29.1 12.54,31.88 v12.79,31.62 R30.2
  Bottom 0.254: v10.51,27.3 10.51,29.34 v12.79,31.62

### Text on the board
tPlace: GND | PWR | DATA | TXO | CHGSTATUS | RXI | SwarmBoard V2 | 11-26-12 | CPRC
bPlace: PA4T | MA+ | MA- | B+ | +3V | GND | B- | PA3 | PA2 | PA1 | MB+ | MB-
tDocu: Long lead = circle for IR detector